# Altium project harmonicAnalyzerProject_r001.PrjPCB
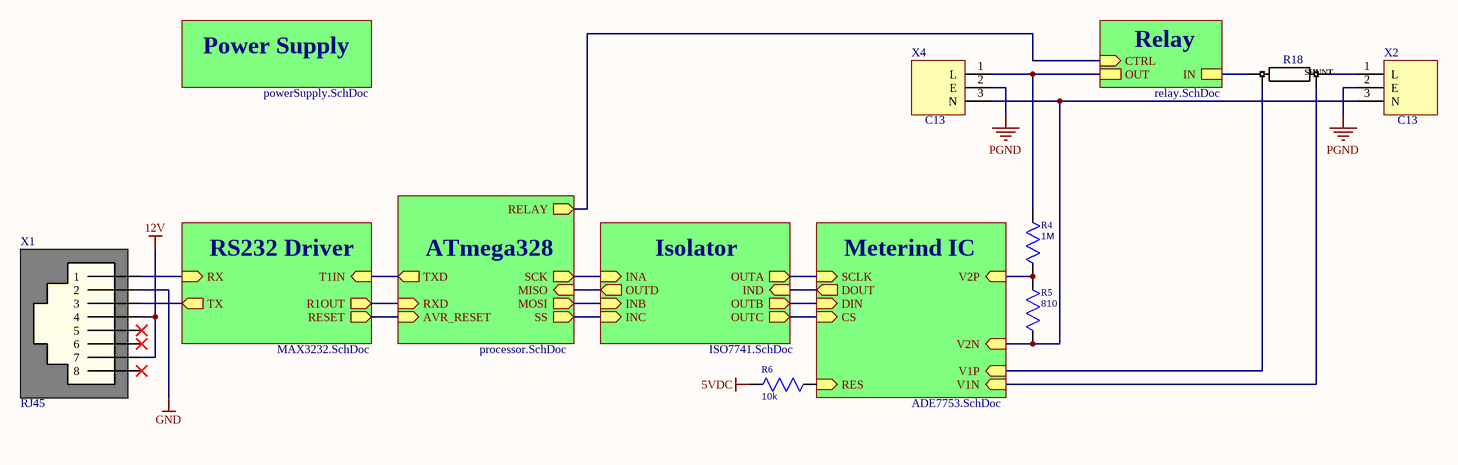
[diagram p0: harmonicAnalyzer.SchDoc]
5 sheets, 61 parts. Net scope: hierarchical (ports join the sheet entries above them; power ports are global).
Board file: harmonicAnalyzerPcb.PcbDoc
Sheets:
  harmonicAnalyzer.SchDoc
    RS232 Driver = MAX3232.SchDoc
    ATmega328 = processor.SchDoc
    Meterind IC = ADE7753.SchDoc
    Relay = relay.SchDoc

## Sheet harmonicAnalyzer.SchDoc
size A4

### Parts
R4  1M  [R_0805]
R5  810  [R_0805]
R6  10k  [R_0603]
R18  SHUNT  [WSHP2818]  (value not drawn)
X1  RJ45  [RJ45]
X2  C13  [C13_RA_TH]
X4  C13  [C13_RA_TH]

### Sub-sheets
ATmega328 = processor.SchDoc: MOSI (out), SS (out), MISO (in), RXD (in), SCK (out), TXD (out), AVR_RESET (in), RELAY (out)
Isolator = ISO7741.SchDoc (file not in this document): OUTC (out), IND (in), INC (in), OUTD (out), INA (in), OUTB (out), OUTA (out), INB (in)
Meterind IC = ADE7753.SchDoc: DOUT (out), CS (in), V2N (in), V2P (in), DIN (in), RES (in), SCLK (in), V1N (in), V1P (in)
Power Supply = powerSupply.SchDoc (file not in this document): no entries
Relay = relay.SchDoc: CTRL (in), OUT, IN
RS232 Driver = MAX3232.SchDoc: T1IN (in), RX (in), TX (out), R1OUT (out), RESET (out)

### Nets
5VDC: R6.1
12V: X1.4 X1.7
GND: X1.2
PGND: X2.2(E) X4.2(E)
AVR_RESET: sheet RS232 Driver/RESET, sheet ATmega328/AVR_RESET
CS: sheet Isolator/OUTC, sheet Meterind IC/CS
DIN: sheet Isolator/OUTB, sheet Meterind IC/DIN
DOUT: sheet Isolator/IND, sheet Meterind IC/DOUT
R1OUT: sheet RS232 Driver/R1OUT, sheet ATmega328/RXD
RES: R6.2 ; sheet Meterind IC/RES
RX: X1.1 ; sheet RS232 Driver/RX
SCLK: sheet Isolator/OUTA, sheet Meterind IC/SCLK
SS: sheet ATmega328/SS, sheet Isolator/INC
T1IN: sheet RS232 Driver/T1IN, sheet ATmega328/TXD
TX: X1.3 ; sheet RS232 Driver/TX
V1N: R18.3 ; sheet Meterind IC/V1N
V1P: R18.4 ; sheet Meterind IC/V1P
V2N: R5.2 X2.3(N) X4.3(N) ; sheet Meterind IC/V2N
V2P: R4.2 R5.1 ; sheet Meterind IC/V2P
NetIC6_25: sheet ATmega328/RELAY, sheet Relay/CTRL
NetJP1_1: sheet ATmega328/MOSI, sheet Isolator/INB
NetJP2_1: sheet ATmega328/MISO, sheet Isolator/OUTD
NetJP3_2: sheet ATmega328/SCK, sheet Isolator/INA
NetR4_1: R4.1 X4.1(L) ; sheet Relay/OUT
NetR18_1: R18.1 X2.1(L)
NetR18_2: R18.2 ; sheet Relay/IN

Not connected (* = marked no-connect by the designer): X1 5* 6* 8*

### Library data of the parts
R4 R5 = R0805: Resistor
  R4: Value: 1M
  R5: Value: 810
R6 = R0603: Resistor; Value: 10k
R18 = SHUNT: Current Shunt; Link: https://www.digikey.com/product-detail/en/vishay-dale/WSHP2818R0330FEA/541-3279-1-ND/6605255
X1 = RJ45: Outlet YH-55-05 8P8C 5521; Link: https://www.rcscomponents.kiev.ua/product/rozetka-yh-55-05-8p8c-5521-l-kls12-133-8p8c-w-o-2-01_8324.html

## Sheet MAX3232.SchDoc
size A4
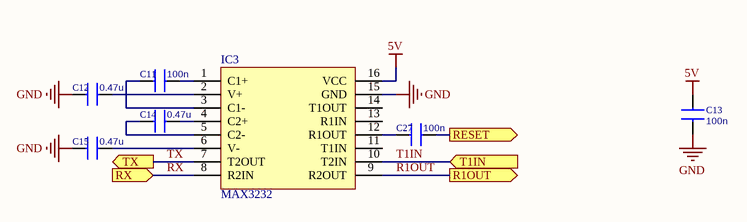
[diagram p1: MAX3232.SchDoc]

### Parts
C11  100n  [C_0805]
C12  0.47u  [C_0805]
C13  100n  [C_0805]
C14  0.47u  [C_0805]
C15  0.47u  [C_0805]
C27  100n  [C_0805]
IC3  MAX3232  [SSOP-16]

### Ports
R1OUT (out), RESET (out), RX (in), T1IN (in), TX (out)

### Nets
5V: C13.2 IC3.16(VCC)
GND: C12.1 C13.1 C15.1 IC3.15(GND)
AVR_RESET: C27.2 ; port RESET
R1OUT: IC3.9(R2OUT) ; port R1OUT
RX: IC3.8(R2IN) ; port RX
T1IN: IC3.10(T2IN) ; port T1IN
TX: IC3.7(T2OUT) ; port TX
NetC11_1: C11.1 IC3.3(C1-)
NetC11_2: C11.2 IC3.1(C1+)
NetC12_2: C12.2 IC3.2(V+)
NetC14_1: C14.1 IC3.5(C2-)
NetC14_2: C14.2 IC3.4(C2+)
NetC15_2: C15.2 IC3.6(V-)
NetC27_1: C27.1 IC3.12(R1OUT)

Not connected (* = marked no-connect by the designer): IC3 11(T1IN) 13(R1IN) 14(T1OUT)

### Library data of the parts
C11-C15 C27 = C0805: Capacitor
  C11 C13 C27: Value: 100n
  C12 C14 C15: Value: 0.47u
IC3 = MAX3232: RS-232 Line Driver/Receiver With ±15-kV ESD Protection

## Sheet processor.SchDoc
size A4
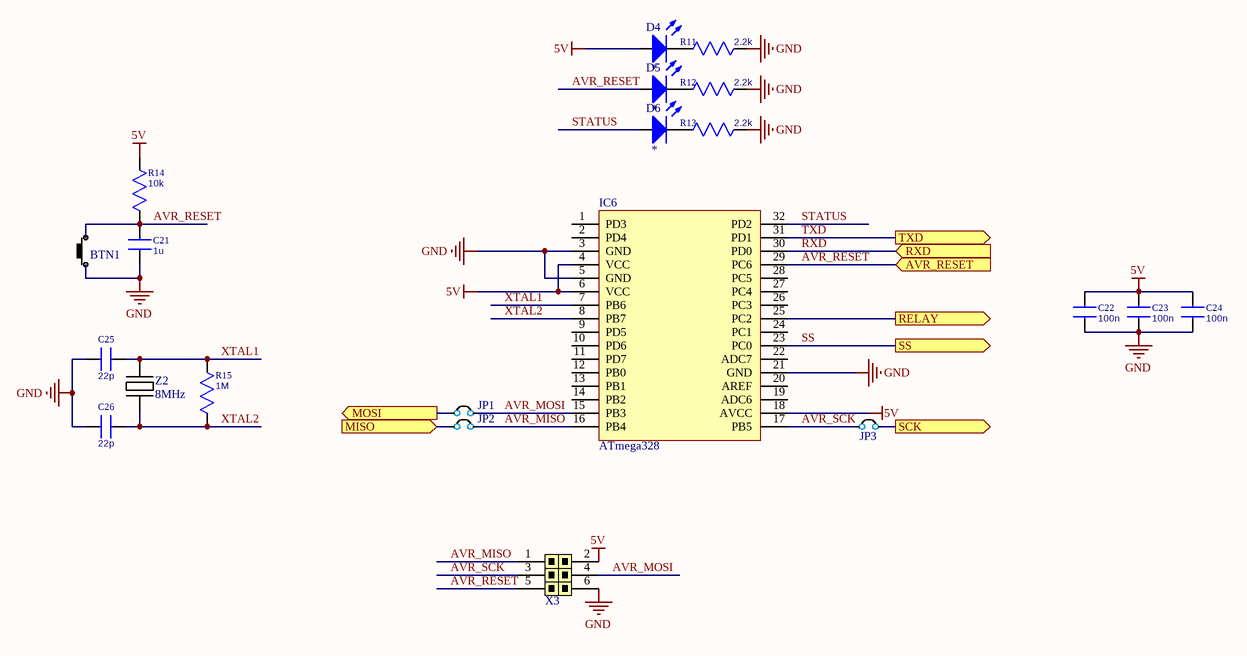
[diagram p2: processor.SchDoc]

### Parts
BTN1  Push Button  [PUSH BUTTON RIGHT ANGLE]  (value not drawn)
C21  1u  [C_0603]
C22  100n  [C_0603]
C23  100n  [C_0603]
C24  100n  [C_0603]
C25  22p  [C_0603]
C26  22p  [C_0603]
D4  *  [LED_5mm]
D5  *  [LED_5mm]
D6  *  [LED_5mm]
IC6  ATmega328  [TQFP-32]
JP1  PLS-2  [PLS-2]  (value not drawn)
JP2  PLS-2  [PLS-2]  (value not drawn)
JP3  PLS-2  [PLS-2]  (value not drawn)
R11  2.2k  [R_0603]
R12  2.2k  [R_0603]
R13  2.2k  [R_0603]
R14  10k  [R_0603]
R15  1M  [R_0603]
X3  PLD-6  [PLD-6]  (value not drawn)
Z2  8MHz  [HC-49]

### Ports
AVR_RESET (in), MISO (in), MOSI (out), RELAY (out), RXD (in), SCK (out), SS (out), TXD (out)

### Nets
5V: C22.2 C23.2 C24.2 D4.1(A) IC6.4(VCC) IC6.6(VCC) IC6.18(AVCC) R14.1 X3.2
GND: BTN1.2 C21.1 C22.1 C23.1 C24.1 C25.2 C26.2 IC6.3(GND) IC6.5(GND) IC6.21(GND) R11.2 R12.2 R13.2 X3.6
AVR_MISO: IC6.16(PB4) JP2.2 X3.1
AVR_MOSI: IC6.15(PB3) JP1.2 X3.4
AVR_RESET: BTN1.1 C21.2 D5.1(A) IC6.29(PC6) R14.2 X3.5 ; port AVR_RESET
AVR_SCK: IC6.17(PB5) JP3.1 X3.3
RXD: IC6.30(PD0) ; port RXD  [project net R1OUT]
SS: IC6.23(PC0) ; port SS
STATUS: D6.1(A) IC6.32(PD2)
TXD: IC6.31(PD1) ; port TXD  [project net T1IN]
XTAL1: C25.1 IC6.7(PB6) R15.1 Z2.2
XTAL2: C26.1 IC6.8(PB7) R15.2 Z2.1
NetD4_2: D4.2(K) R11.1
NetD5_2: D5.2(K) R12.1
NetD6_2: D6.2(K) R13.1
NetIC6_25: IC6.25(PC2) ; port RELAY
NetJP1_1: JP1.1 ; port MOSI
NetJP2_1: JP2.1 ; port MISO
NetJP3_2: JP3.2 ; port SCK

Not connected (* = marked no-connect by the designer): IC6 1(PD3) 2(PD4) 9(PD5) 10(PD6) 11(PD7) 12(PB0) 13(PB1) 14(PB2) 19(ADC6) 20(AREF) 22(ADC7) 24(PC1) 26(PC3) 27(PC4) 28(PC5)

### Library data of the parts
C21-C26 = C0603: Capacitor
  C21: Value: 1u
  C22-C24: Value: 100n
  C25 C26: Value: 22p
D4-D6 = LED_5mm: Typical INFRARED GaAs LED; Value: *; Color: *
IC6 = ATmega328: High Performance, Low Power Atmel AVR 8-Bit Microcontroller
JP1-JP3 = JP-2: Jumper Pins; Type: PLS-2
R11-R15 = R0603: Resistor
  R11-R13: Value: 2.2k
  R14: Value: 10k
  R15: Value: 1M
Z2 = XTAL: Quartz resonator

## Sheet ADE7753.SchDoc
size A
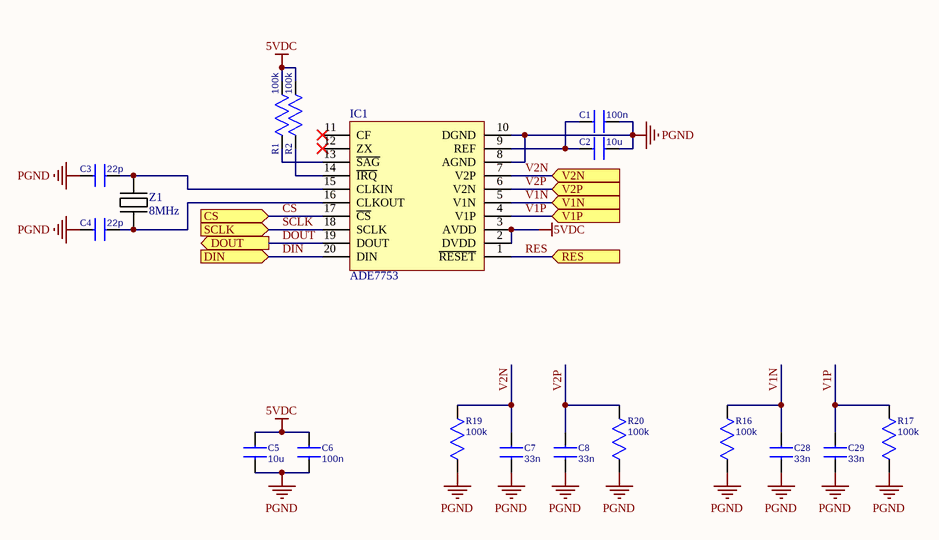
[diagram p3: ADE7753.SchDoc]

### Parts
C1  100n  [C_0603]
C2  10u  [C_0805]
C3  22p  [C_0603]
C4  22p  [C_0603]
C5  10u  [C_0805]
C6  100n  [C_0603]
C7  33n  [C_0603]
C8  33n  [C_0603]
C28  33n  [C_0603]
C29  33n  [C_0603]
IC1  ADE7753  [SOP-20]
R1  100k  [R_0603]
R2  100k  [R_0603]
R16  100k  [R_0603]
R17  100k  [R_0603]
R19  100k  [R_0603]
R20  100k  [R_0603]
Z1  8MHz  [HC-49]

### Ports
CS (in), DIN (in), DOUT (out), RES (in), SCLK (in), V1N (in), V1P (in), V2N (in), V2P (in)

### Nets
5VDC: C5.2 C6.2 IC1.2(DVDD) IC1.3(AVDD) R1.2 R2.2
PGND: C1.2 C2.2 C3.1 C4.1 C5.1 C6.1 C7.1 C8.1 C28.1 C29.1 IC1.8(AGND) IC1.10(DGND) R16.2 R17.2 R19.2 R20.2
CS: IC1.17(~{CS}) ; port CS
DIN: IC1.20(DIN) ; port DIN
DOUT: IC1.19(DOUT) ; port DOUT
RES: IC1.1(~{RESET}) ; port RES
SCLK: IC1.18(SCLK) ; port SCLK
V1N: C28.2 IC1.5(V1N) R16.1 ; port V1N
V1P: C29.2 IC1.4(V1P) R17.1 ; port V1P
V2N: C7.2 IC1.7(V2P) R19.1 ; port V2N
V2P: C8.2 IC1.6(V2N) R20.1 ; port V2P
NetC1_1: C1.1 C2.1 IC1.9(REF)
NetC3_2: C3.2 IC1.15(CLKIN) Z1.2
NetC4_2: C4.2 IC1.16(CLKOUT) Z1.1
NetIC1_13: IC1.13(~{SAG}) R1.1
NetIC1_14: IC1.14(~{IRQ}) R2.1

Not connected (* = marked no-connect by the designer): IC1 11(CF)* 12(ZX)*

### Library data of the parts
C1 C3 C4 C6-C8 C28 C29 = C0603: Capacitor
  C1 C6: Value: 100n
  C3 C4: Value: 22p
  C7 C8 C28 C29: Value: 33n
C2 C5 = C0805: Capacitor; Value: 10u
IC1 = ADE7753ARSZ: Data Acquisition ADC/DAC
R1 R2 R16 R17 R19 R20 = R0603: Resistor; Value: 100k
Z1 = XTAL: Quartz resonator

## Sheet relay.SchDoc
size A
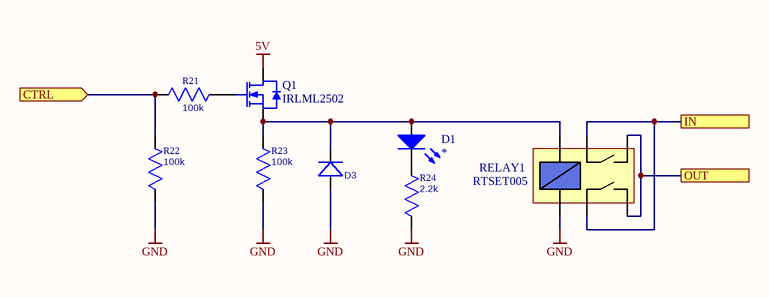
[diagram p4: relay.SchDoc]

### Parts
D1  *  [LED_5mm]
D3  D_DO-214AC  [DO-214AC]  (value not drawn)
Q1  IRLML2502  [SOT23]
R21  100k  [R_0603]
R22  100k  [R_0603]
R23  100k  [R_0603]
R24  2.2k  [R_0603]
RELAY1  RTSET005  [RTSET005]

### Ports
CTRL (in), IN, OUT

### Nets
5V: Q1.3(D)
GND: D3.1(A) R22.2 R23.2 R24.1 RELAY1.6
NetD1_1: D1.1(A) D3.2(K) Q1.2(S) R23.1 RELAY1.5
NetD1_2: D1.2(K) R24.2
NetIC6_25: R21.2 R22.1 ; port CTRL
NetQ1_1: Q1.1(G) R21.1
NetR4_1: RELAY1.1 RELAY1.2 ; port OUT
NetR18_2: RELAY1.3 RELAY1.4 ; port IN

### Library data of the parts
D1 = LED_5mm: Typical INFRARED GaAs LED; Value: *; Color: *
D3 = D_DO-214AC: Diode
Q1 = N-ch_SOT23: N-Channel Enhancement Mode MOSFET; Published: 17-Dec-2003; DatasheetVersion: May-99; PackageVersion: 1996; PackageReference: SOT23; Publisher: Altium Limited; PackageDescription: SOT-23; 3 Leads; Body 3.1 x 2.5 mm, inc. leads (LxW max), Alternate Lead Configuration; ComponentLink1Description: Manufacturer Link; ComponentLink1URL: http://www.zetex.com/; ComponentLink2Description: Datasheet; ComponentLink2URL: www.zetex.com/3.0/pdf/ZXM61N02F.pdf
R21-R24 = R0603: Resistor
  R21-R23: Value: 100k
  R24: Value: 2.2k
RELAY1 = 1-1415898-8: General Purpose Relay

## Nets that join several sheets
5V: MAX3232 (C13.2 IC3.16), processor (9 pins), relay (Q1.3)
5VDC: harmonicAnalyzer (R6.1), ADE7753 (6 pins)
GND: harmonicAnalyzer (X1.2), MAX3232 (C12.1 C13.1 C15.1 IC3.15), processor (14 pins), relay (5 pins)
PGND: harmonicAnalyzer (X2.2 X4.2), ADE7753 (16 pins)
AVR_RESET: MAX3232 (C27.2), processor (6 pins)
NetIC6_25: processor (IC6.25), relay (R21.2 R22.1)
NetR4_1: harmonicAnalyzer (R4.1 X4.1), relay (RELAY1.1 RELAY1.2)
NetR18_2: harmonicAnalyzer (R18.2), relay (RELAY1.3 RELAY1.4)
R1OUT: MAX3232 (IC3.9), processor (IC6.30)
RES: harmonicAnalyzer (R6.2), ADE7753 (IC1.1)
RX: harmonicAnalyzer (X1.1), MAX3232 (IC3.8)
T1IN: MAX3232 (IC3.10), processor (IC6.31)
TX: harmonicAnalyzer (X1.3), MAX3232 (IC3.7)
V1N: harmonicAnalyzer (R18.3), ADE7753 (C28.2 IC1.5 R16.1)
V1P: harmonicAnalyzer (R18.4), ADE7753 (C29.2 IC1.4 R17.1)
V2N: harmonicAnalyzer (R5.2 X2.3 X4.3), ADE7753 (C7.2 IC1.7 R19.1)
V2P: harmonicAnalyzer (R4.2 R5.1), ADE7753 (C8.2 IC1.6 R20.1)